# EAGLE design mp3412-boost-driver-13mm-mk-1.0 (EAGLE 7.5.0)
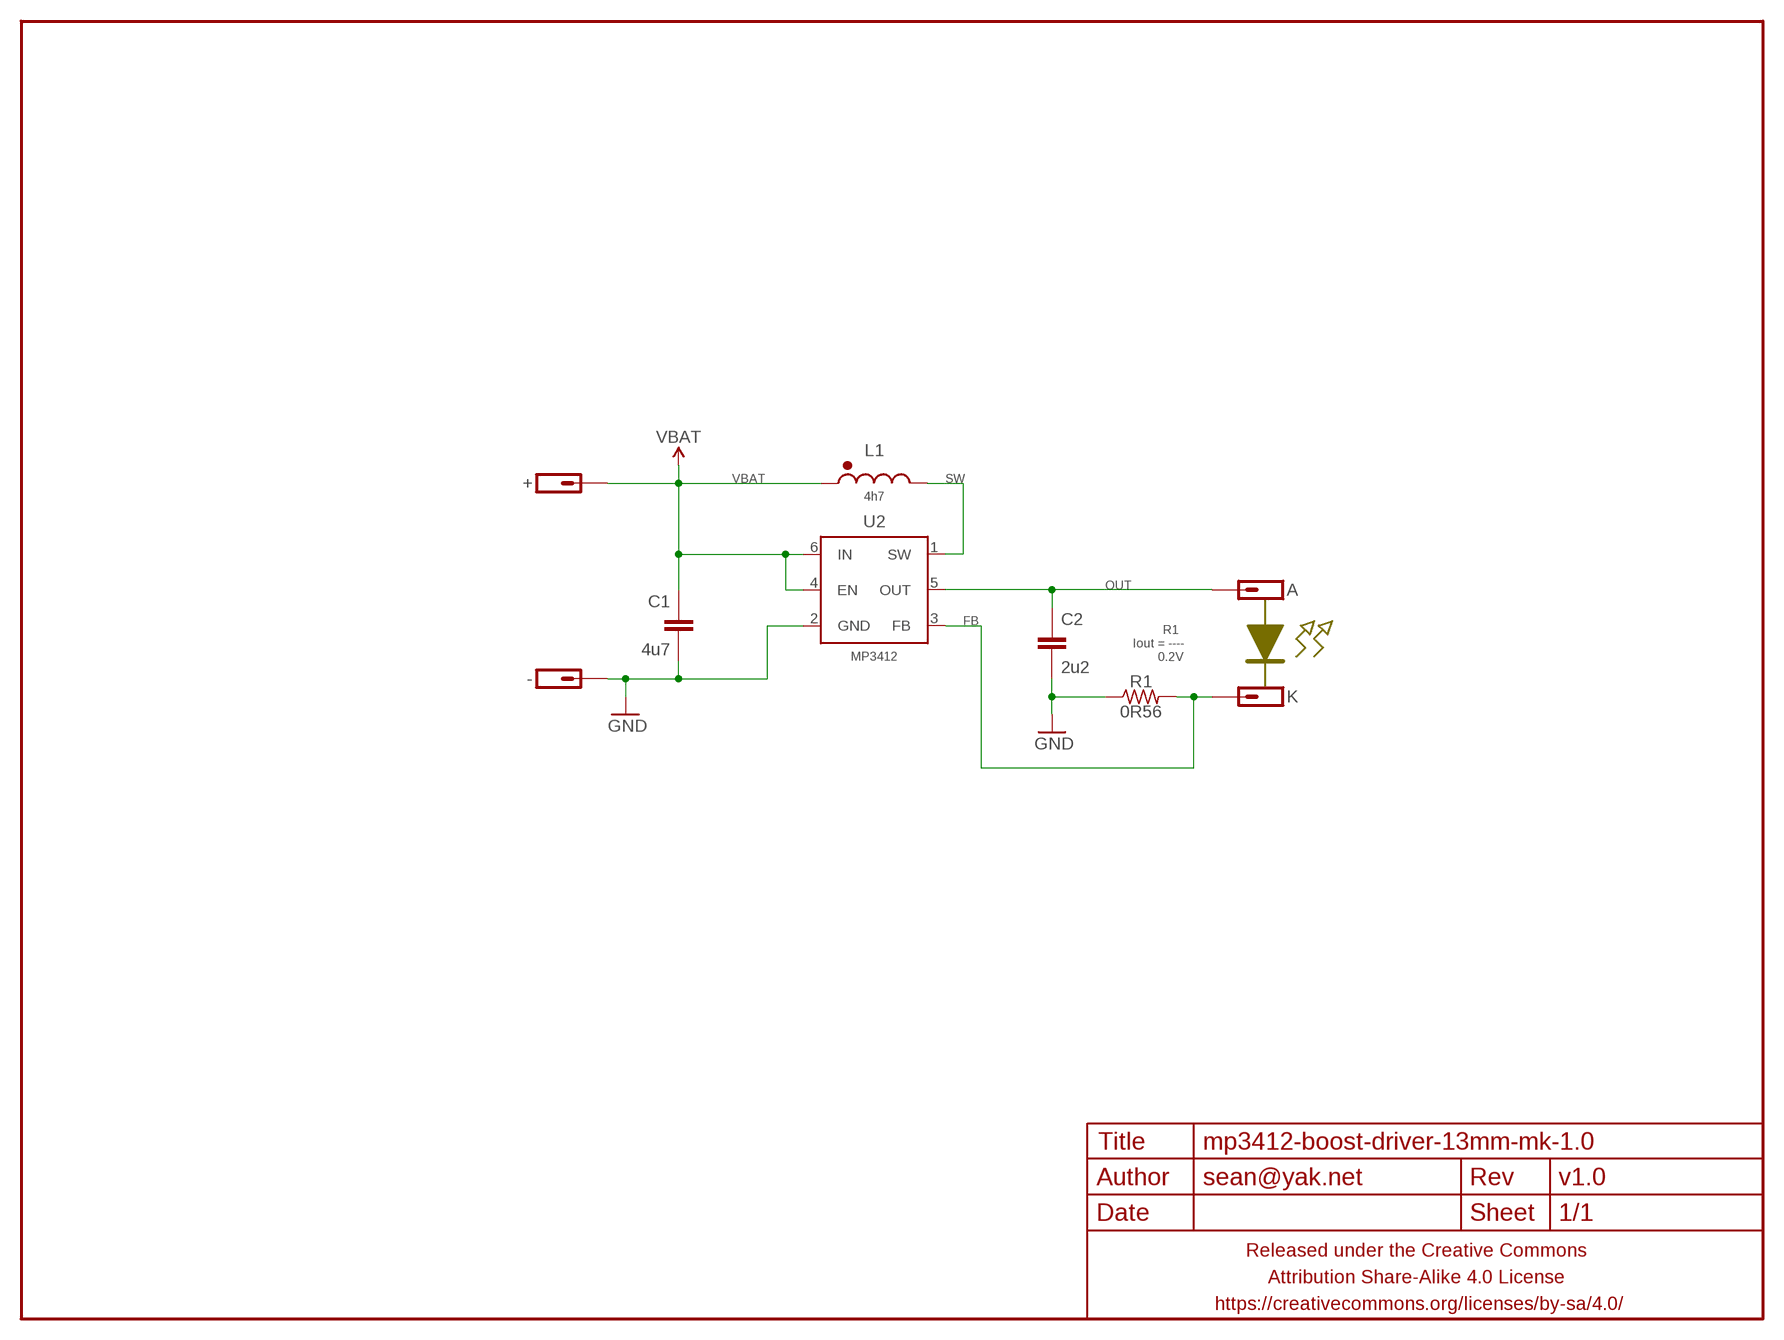
[diagram p0: schematic, sheet 1]

## Parts
+  M01NOT-A-VIA-NOPE  [1X01_NOSILK_NOSTOP]
-  M01NOT-A-VIA-NOPE  [1X01_NOSILK_NOSTOP]
A  M01SMD_1.5X2MM  [1X01_1.5X2MM]
C1  4u7  CAPACITOR-CERAMICC0603-TIGHTER  [C0603-TIGHTER]
C2  2u2  CAPACITOR-CERAMICC0603-TIGHTER  [C0603-TIGHTER]
FRAME1  FRAME-LETTERNO_PACKAGE  [DUMMY]
K  M01SMD_1.5X2MM  [1X01_1.5X2MM]
L1  4h7  INDUCTOREPL2014  [EPL2014]
R1  0R56  RESISTORR0603-TIGHTER  [R0603-TIGHTER]
U2  MP3412  [TSOT-23-6]

## Nets
FB: K.P$1 R1.2 U2.3(FB)
GND: -.P$1 C1.2 C2.2 R1.1 U2.2(GND)
OUT: A.P$1 C2.1 U2.5(OUT)
SW: L1.P$2 U2.1(SW)
VBAT: +.P$1 C1.1 L1.P$1 U2.4(EN) U2.6(IN)

## Notes on the sheet
- R1
  Iout = ----
         0.2V

## Library data of the parts
+ - A K = a_parts:M01: Header 1 Standard 1-pin 0.1" header. Use with straight break away headers (SKU : PRT-00116), right angle break away headers (PRT-00553), swiss pins (PRT-00743), machine pins (PRT-00117), and female headers (PRT-00115).
C1 C2 = a_parts:CAPACITOR-CERAMIC: CAPACITOR, European symbol
FRAME1 = a_parts:FRAME-LETTER: Schematic Frame Standard 8.5x11 US Letter frame; DESIGNER: sean@yak.net; VERSION: v1.0
L1 = a_parts:INDUCTOR: Inductors Basic Inductor/Choke - 0603 and 1206. Footprints are not proven and vary greatly between part numbers. SRN6045- 33uH, 20% 1.4A SDR0403-560KL - 56uH, 10%, 500mA RMS/740mA peak
R1 = a_parts:RESISTOR: RESISTOR, American symbol
U2 = a_parts:MP3412

## Board
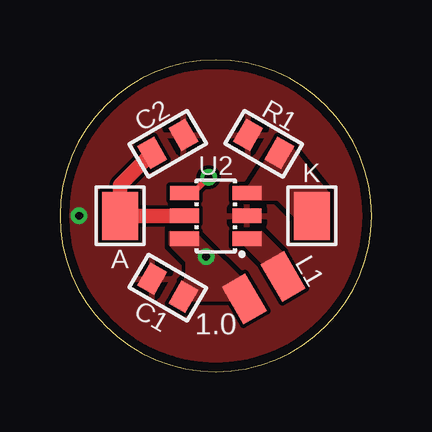
[diagram p1: board, top side]
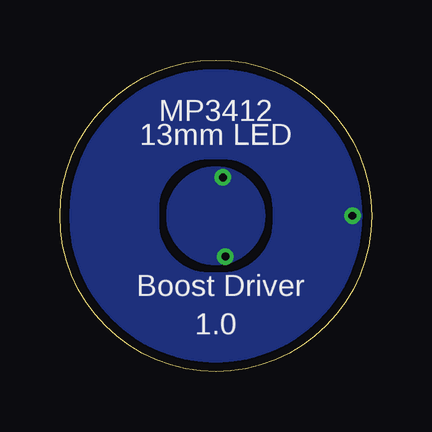
[diagram p2: board, bottom side, seen from below]

Size 13 x 13 mm. Coordinates in mm from the lower left corner, seen from the top.
Outline: 0,6.5 arc180 13,6.5 arc180 0,6.5
Copper layers (1*16): Top 0.0356mm / dielectric 1.5011mm / Bottom 0.0356mm
Design rules "LaenPCBOrder2": minimum track width 6mil, minimum drill 13mil, track to track 6mil, track to pad 6mil, pad to pad 6mil, via to via 6mil, smd to smd 6mil, copper to edge 15mil, drill to drill 6mil, minimum pad ring 7mil, minimum via ring 7mil, stop-mask expansion 3mil, vias tented up to drill 20mil, thermal gap 10mil

### Footprints (pad centres in the part's own frame; a part is rotated, then mirrored left to right if it is on the bottom)
1X01_NOSILK_NOSTOP = drill 0.33: P$1 0,0
1X01_1.5X2MM = smd 1.5 x 2: P$1 0,0
C0603-TIGHTER = smd 0.8 x 1.1: 1 -0.75,0; 2 0.75,0
EPL2014 = smd 1.125 x 1.8: P$1 -0.938,0; P$2 0.938,0
R0603-TIGHTER = smd 0.8 x 1.1: 1 -0.75,0; 2 0.75,0
TSOT-23-6 = smd 0.6 x 1.2: 1 -0.95,-1.3; 2 0,-1.3; 3 0.95,-1.3; 4 0.95,1.3; 5 0,1.3; 6 -0.95,1.3

### Placement (x,y rotation side)
+  6.1,4.8 0 bottom
-  0.8,6.5 90 bottom
A  2.5,6.5 180 top
C1  4.5,3.5 150 top
C2  4.5,9.5 30 top
FRAME1  0,0 0 top
K  10.5,6.5 0 top
L1  8.5,3.5 30 top
R1  8.5,9.5 330 top
U2  6.5,6.5 90 top

### Tracks (layer width: path | path; a pad name or v marks a point on that pad's centre or on a via)
FB
  pour Top (isolate 0.152, no thermals): 7.5,7.7 7.5,7.2 9.1,7.2 9.8,6.5 11.2,6.5 11.2,7.4 9.6,9.4 9,9.4 7.9,7.7
GND
  pour Top (isolate 0.152, rank 6): 0,0 0,13 13,13 13,0
  pour Bottom (isolate 0.305, rank 6): 0,0 0,13 13,13 13,0
OUT
  Top 0.6: U2.5 A.P$1 2.5,7.78 C2.1
SW
  pour Top (isolate 0.152, no thermals): 7.3,5.8 7.3,5.3 7.7,5.3 8.5,4.5 9.5,4.5 9.3,4.7 9.3,4.9 8.4,5.8
VBAT  (via drill 0.33)
  Top 0.25: U2.4 5.55,7.45 v6.2,8.1
  pour Bottom (isolate 0.152, no thermals): 6.5,4.5 arc-90 4.5,6.5 arc-90 6.5,8.5 arc-90 8.5,6.5 arc-90
  pour Top (isolate 0.152, no thermals): 4.6,5.8 4.6,5.3 5.3,4.6 5.3,3.9 5.1,3.7 5.1,3 8,3 8,3.4 5.6,5.8

### Text on the board
bPlace: MP3412 | 13mm LED | Boost Driver